# EAGLE design SPI Level Shifter (EAGLE 6.2)
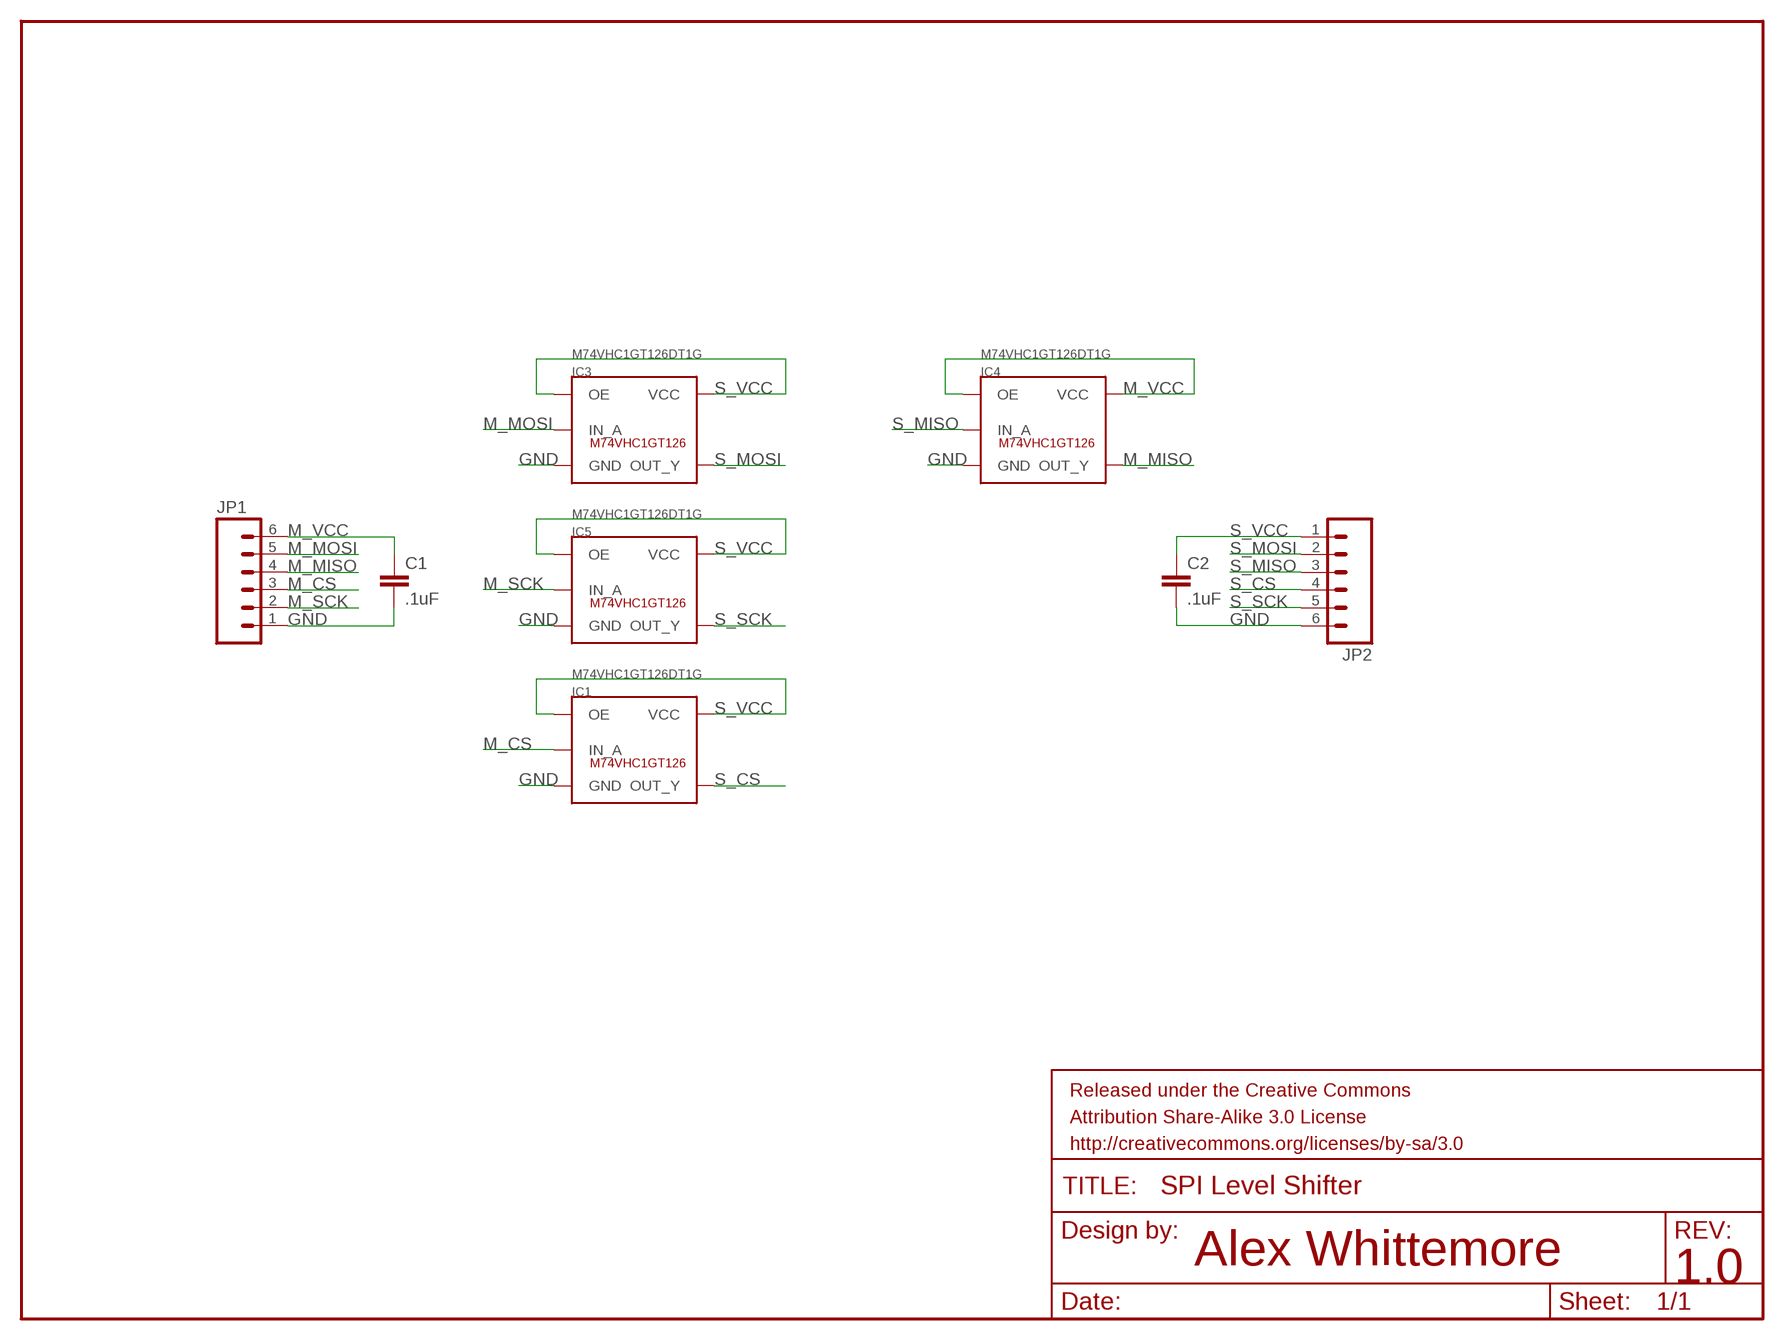
[diagram p0: schematic, sheet 1]

## Parts
C1  .1uF  CAP0402-CAP  [0402-CAP]
C2  .1uF  CAP0402-CAP  [0402-CAP]
IC1  M74VHC1GT126DT1G  [SOT23-5L]
IC3  M74VHC1GT126DT1G  [SOT23-5L]
IC4  M74VHC1GT126DT1G  [SOT23-5L]
IC5  M74VHC1GT126DT1G  [SOT23-5L]
JP1  M06LOCK  [1X06_LOCK]
JP2  M06LOCK  [1X06_LOCK]

## Nets
GND: C1.2 C2.2 IC1.3(GND) IC3.3(GND) IC4.3(GND) IC5.3(GND) JP1.1 JP2.6
M_CS: IC1.2(IN_A) JP1.3
M_MISO: IC4.4(OUT_Y) JP1.4
M_MOSI: IC3.2(IN_A) JP1.5
M_SCK: IC5.2(IN_A) JP1.2
M_VCC: C1.1 IC4.1(OE) IC4.5(VCC) JP1.6
S_CS: IC1.4(OUT_Y) JP2.4
S_MISO: IC4.2(IN_A) JP2.3
S_MOSI: IC3.4(OUT_Y) JP2.2
S_SCK: IC5.4(OUT_Y) JP2.5
S_VCC: C2.1 IC1.1(OE) IC1.5(VCC) IC3.1(OE) IC3.5(VCC) IC5.1(OE) IC5.5(VCC) JP2.1

## Notes on the sheet
- Alex Whittemore
- 1.0

## Library data of the parts
C1 C2 = SparkFun-Passives:CAP: Capacitor Standard 0603 ceramic capacitor, and 0.1" leaded capacitor.
IC1 IC3-IC5 = AlexW-Eagle-Libraries:M74VHC1GT126
JP1 JP2 = SparkFun-Connectors:M06: Header 6 Standard 6-pin 0.1" header. Use with straight break away headers (SKU : PRT-00116), right angle break away headers (PRT-00553), swiss pins (PRT-00743), machine pins (PRT-00117), and female headers (PRT-00115). Molex polarized connector foot print use with SKU : PRT-08094 with associated crimp pins and housings. NOTES ON THE VARIANTS LOCK and LOCK_LONGPADS... This footprint was designed to help hold the alignment of a through-hole component (i.e. 6-pin header) while soldering it into place. You may notice that each hole has been shifted either up or down by 0.005 of an inch from it's more standard position (which is a perfectly straight line). This slight alteration caused the pins (the squares in the middle) to touch the edges of the holes. Because they are alternating, it causes a "brace" to hold the component in place. 0.005 has proven to be the perfect amount of "off-center" position when using our standard breakaway headers. Although looks a little odd when you look at the bare footprint, once you have a header in there, the alteration is very hard to notice. Also, if you push a header all the way into place, it is covered up entirely on the bottom side. This idea of altering the position of holes to aid alignment will be further integrated into the Sparkfun Library for other footprints. It can help hold any component with 3 or more connection pins.

## Board
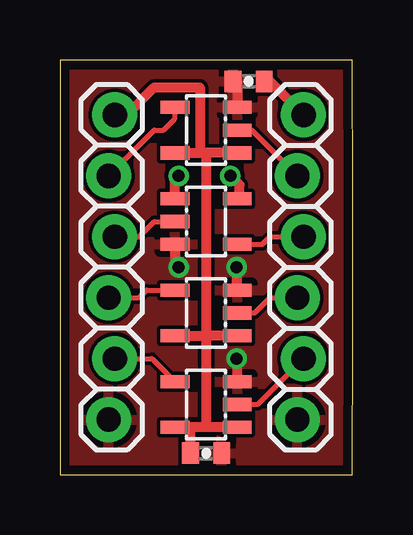
[diagram p1: board, top side]
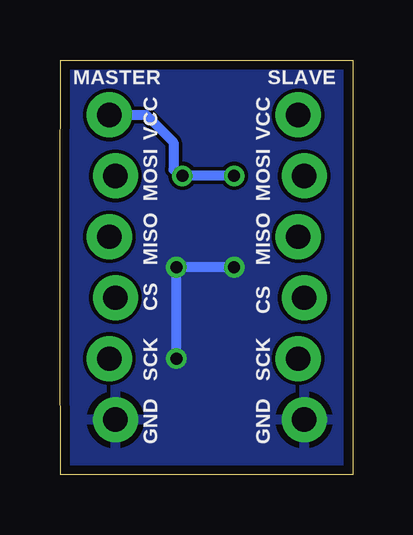
[diagram p2: board, bottom side, seen from below]

Size 12.22 x 17.27 mm. Coordinates in mm from the lower left corner, seen from the top.
Outline: 0,0 12.19,0 arc1 12.19,17.27 0,17.27 0,0
Copper layers (1*16): Top 0.0356mm / dielectric 1.5011mm / Bottom 0.0356mm
Design rules: minimum track width 6mil, minimum drill 13mil, track to track 6mil, track to pad 6mil, pad to pad 6mil, via to via 6mil, smd to smd 6mil, copper to edge 15mil, drill to drill 6mil, minimum pad ring 7mil, minimum via ring 7mil, stop-mask expansion 4mil, vias tented up to drill 0mil, thermal gap 10mil

### Footprints (pad centres in the part's own frame; a part is rotated, then mirrored left to right if it is on the bottom)
0402-CAP = smd 0.7 x 0.9: 1 -0.65,0; 2 0.65,0
SOT23-5L = smd 0.55 x 1.2: 1 -0.95,-1.3; 2 0,-1.3; 3 0.95,-1.3; 4 0.95,1.3; 5 -0.95,1.3
1X06_LOCK = drill 1.016 pad 1.88: 1 0,0; 2 2.54,-0.254; 3 5.08,0; 4 7.62,-0.254; 5 10.16,0; 6 12.7,-0.254

### Placement (x,y rotation side)
C1  7.87,16.38 180 top
C2  6.1,0.89 0 top
IC1  6.1,6.73 90 top
IC3  6.1,14.35 90 top
IC4  6.1,10.54 270 top
IC5  6.1,2.92 90 top
JP1  9.91,2.29 90 top
JP2  2.29,14.99 270 top

### Tracks (layer width: path | path; a pad name or v marks a point on that pad's centre or on a via)
GND  (via drill 0.5)
  Top 0.406: IC4.3 4.8,8.79 v4.95,8.64 | v7.37,8.64 7.37,7.71 IC1.3 | IC5.3 7.4,4.67 v7.37,4.83 | C1.2 7.4,16.38 IC3.3
  Bottom 0.406: v4.95,8.64 v7.37,8.64 v7.37,4.83 | JP1.1 9.78,2.29
  pour Top: 0,0 0,17.27 12.19,17.27 12.19,0
  pour Bottom: 0,17.27 12.19,17.27 12.19,0 0,0
M_CS
  Top 0.203: IC1.2 8.13,6.73 8.76,7.37 JP1.3
M_MISO
  Top 0.203: IC4.4 8.45,9.59 8.76,9.91 JP1.4
M_MOSI
  Top 0.203: IC3.2 8,14.35 JP1.5
M_SCK
  Top 0.203: IC5.2 8.26,2.92 JP1.2
M_VCC  (via drill 0.5)
  Top 0.406: IC4.1 4.8,12.29 v4.95,12.45 | IC4.5 7.49,11.59 7.49,12.06 v7.11,12.45 | C1.1 8.76,16.38 JP1.6
  Bottom 0.406: v4.95,12.45 v7.11,12.45 7.49,12.7 7.49,13.84 8.64,14.99 JP1.6
S_CS
  Top 0.203: JP2.4 3.3,7.37 3.62,7.68 IC1.4
S_MISO
  Top 0.203: JP2.3 3.3,9.91 3.94,10.54 IC4.2
S_MOSI
  Top 0.203: JP2.2 3.94,14.35 4.32,14.35 4.8,14.83 IC3.4
S_SCK
  Top 0.203: JP2.5 3.84,4.83 IC5.4
S_VCC
  Top 0.406: JP2.1 2.79,14.99 3.94,16.13 5.84,16.13 5.84,13.4 | 6.1,13.4 6.1,5.78 | 6.1,5.78 6.1,1.97 | 6.1,1.97 5.59,1.97 | 5.59,1.97 IC5.5 | IC5.1 6.1,1.97 | IC1.5 6.1,5.78 | IC1.1 6.1,5.78 | IC3.5 5.84,13.4 | 5.84,13.4 6.1,13.4 | IC3.1 6.1,13.4 | C2.1 5.45,1.83 5.59,1.97

### Text on the board
bPlace: SLAVE | VCC | VCC | MASTER | MOSI | MOSI | MISO | MISO | CS | CS | SCK | SCK | GND | GND